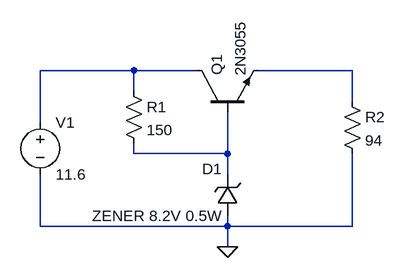
[diagram p0: schematic Draft1.asc]
Draft1.asc, the LTspice schematic file:
Version 4
SHEET 1 880 680
WIRE 0 128 -144 128
WIRE 96 128 0 128
WIRE 336 128 192 128
WIRE 0 160 0 128
WIRE 336 176 336 128
WIRE -144 208 -144 128
WIRE 0 256 0 240
WIRE 144 256 144 192
WIRE 144 256 0 256
WIRE 144 288 144 256
WIRE -144 368 -144 288
WIRE 144 368 144 352
WIRE 144 368 -144 368
WIRE 336 368 336 256
WIRE 336 368 144 368
WIRE 144 400 144 368
FLAG 144 400 0
SYMBOL npn 96 192 R270
SYMATTR InstName Q1
SYMATTR Value 2N3055
SYMBOL res -16 144 R0
SYMATTR InstName R1
SYMATTR Value 150
SYMBOL res 320 160 R0
SYMATTR InstName R2
SYMATTR Value 94
SYMBOL voltage -144 192 R0
WINDOW 123 0 0 Left 0
WINDOW 39 0 0 Left 0
SYMATTR InstName V1
SYMATTR Value 11.6
SYMBOL zener 160 352 R180
WINDOW 0 24 72 Left 0
WINDOW 3 24 0 Left 0
SYMATTR InstName D1
SYMATTR Value ZENER 8.2V 0.5W

The netlist it stands for:
* Draft1.asc
Q1 N001 N003 N002 0 2N3055
R1 N001 N003 150
R2 N002 0 94
V1 N001 0 11.6
D1 0 N003 ZENER 8.2V 0.5W
.model D D
.lib standard.dio
.model NPN NPN
.model PNP PNP
.lib standard.bjt
.backanno
.end